# EAGLE design esp32comp (EAGLE 9.5.2)
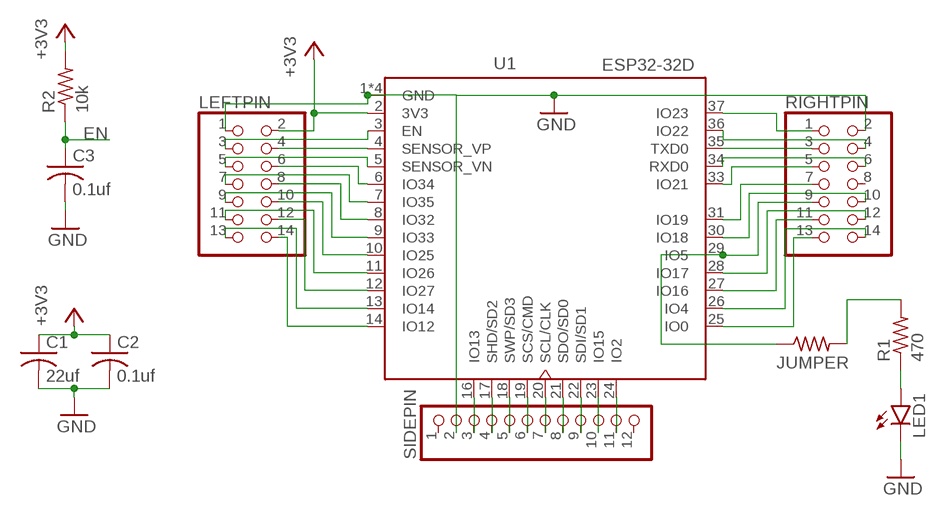
[diagram p0: schematic, sheet 1]

## Parts
C1  22uf  C-USC1210  [C1210]
C2  0.1uf  C-USC0805  [C0805]
C3  0.1uf  C-USC0805  [C0805]
JUMPER  RC0603JR-070RL  [RES_0603]
LED1  LEDSML0805  [SML0805]
LEFTPIN  PINHD-2X7  [2X07]
R1  470  R-US_R0805  [R0805]
R2  10k  R-US_R0805  [R0805]
RIGHTPIN  PINHD-2X7  [2X07]
SIDEPIN  PINHD-1X12  [1X12]
U1  ESP32-32D  [MODULE_ESP32-WROOM-32D]

## Nets
+3V3: C1.1 C2.1 LEFTPIN.2 R2.2 U1.2(3V3)
EN: C3.1 LEFTPIN.3 R2.1 U1.3(EN)
GND: C1.2 C2.2 C3.2 LED1.C LEFTPIN.1 RIGHTPIN.2 SIDEPIN.2 U1.1(GND) U1.15(GND) U1.38(GND) U1.39(GND)
IO0: RIGHTPIN.13 U1.25(IO0)
IO2: SIDEPIN.11 U1.24(IO2)
N$1: LED1.A R1.1
N$2: JUMPER.2 R1.2
N$3: SIDEPIN.10 U1.23(IO15)
N$10: SIDEPIN.3 U1.16(IO13)
N$13: LEFTPIN.4 U1.4(SENSOR_VP)
N$14: LEFTPIN.5 U1.5(SENSOR_VN)
N$15: LEFTPIN.6 U1.6(IO34)
N$16: LEFTPIN.7 U1.7(IO35)
N$17: LEFTPIN.8 U1.8(IO32)
N$18: LEFTPIN.9 U1.9(IO33)
N$19: LEFTPIN.10 U1.10(IO25)
N$20: LEFTPIN.11 U1.11(IO26)
N$21: LEFTPIN.12 U1.12(IO27)
N$22: LEFTPIN.13 U1.13(IO14)
N$23: LEFTPIN.14 U1.14(IO12)
N$24: RIGHTPIN.1 U1.37(IO23)
N$25: RIGHTPIN.4 U1.36(IO22)
N$28: RIGHTPIN.5 U1.33(IO21)
N$29: RIGHTPIN.7 U1.31(IO19)
N$30: RIGHTPIN.10 U1.30(IO18)
N$31: JUMPER.1 RIGHTPIN.9 U1.29(IO5)
N$33: RIGHTPIN.12 U1.28(IO17)
N$34: RIGHTPIN.11 U1.27(IO16)
N$35: RIGHTPIN.14 U1.26(IO4)
RXD0: RIGHTPIN.6 U1.34(RXD0)
SCL/CLK: SIDEPIN.7 U1.20(SCL/CLK)
SCS/CMD: SIDEPIN.6 U1.19(SCS/CMD)
SDI/SD1: SIDEPIN.9 U1.22(SDI/SD1)
SDO/SD0: SIDEPIN.8 U1.21(SDO/SD0)
SHD/SD2: SIDEPIN.4 U1.17(SHD/SD2)
SWP/SD3: SIDEPIN.5 U1.18(SWP/SD3)
TXD0: RIGHTPIN.3 U1.35(TXD0)
Unconnected: RIGHTPIN.8 SIDEPIN.1 SIDEPIN.12

## Library data of the parts
C1-C3 = rcl:C-US: CAPACITOR, American symbol; SPICEPREFIX: C
JUMPER = Resistor_Capacitor:RC0603JR-070RL: RES SMD 0 OHM JUMPER 1/10W 0603 Manufacturer's datasheet <http://www.yageo.com/documents/recent/PYu-RC_Group_51_RoHS_L_10.pdf>; CREATED_BY: PCBLayout.com; DIGIKEY_PART_NUMBER: 311-0.0GRTR-ND; MANUFACTURER: Yageo; MPN: RC0603JR-070RL; PACKAGE: SMD 0603
LED1 = led:LED: LED OSRAM: - CHIPLED LG R971, LG N971, LY N971, LG Q971, LY Q971, LO R971, LY R971 LH N974, LH R974 LS Q976, LO Q976, LY Q976 LO Q996 - Hyper CHIPLED LW Q18S LB Q993, LB Q99A, LB R99A - SideLED LS A670, LO A670, LY A670, LG A670, LP A670 LB A673, LV A673, LT A673, LW A673 LH A674 LY A675 LS A676, LA A676, LO A676, LY A676, LW A676 LS A679, LY A679, LG A679 - Hyper Micro SIDELED® LS Y876, LA Y876, LO Y876, LY Y876 LT Y87S - SmartLED LW L88C, LW L88S LB L89C, LB L89S, LG L890 LS L89K, LO L89K, LY L89K LS L896, LA L896, LO L896, LY L896 - TOPLED LS T670, LO T670, LY T670, LG T670, LP T670 LSG T670, LSP T670, LSY T670, LOP T670, LYG T670 LG T671, LOG T671, LSG T671 LB T673, LV T673, LT T673, LW T673 LH T674 LS T676, LA T676, LO T676, LY T676, LB T676, LH T676, LSB T676, LW T676 LB T67C, LV T67C, LT T67C, LS T67K, LO T67K, LY T67K, LW E67C LS E67B, LA E67B, LO E67B, LY E67B, LB E67C, LV E67C, LT E67C LW T67C LS T679, LY T679, LG T679 LS T770, LO T770, LY T770, LG T770, LP T770 LB T773, LV T773, LT T773, LW T773 LH T774 LS E675, LA E675, LY E675, LS T675 LS T776, LA T776, LO T776, LY T776, LB T776 LHGB T686 LT T68C, LB T68C - Hyper Mini TOPLED® LB M676 - Mini TOPLED Santana® LG M470 LS M47K, LO M47K, LY M47K Source: http://www.osram.convergy.de LUXEON: - LUMILED® LXK2-PW12-R00, LXK2-PW12-S00, LXK2-PW14-U00, LXK2-PW14-V00 LXK2-PM12-R00, LXK2-PM12-S00, LXK2-PM14-U00 LXK2-PE12-Q00, LXK2-PE12-R00, LXK2-PE12-S00, LXK2-PE14-T00, LXK2-PE14-U00 LXK2-PB12-K00, LXK2-PB12-L00, LXK2-PB12-M00, LXK2-PB14-N00, LXK2-PB14-P00, LXK2-PB14-Q00 LXK2-PR12-L00, LXK2-PR12-M00, LXK2-PR14-Q00, LXK2-PR14-R00 LXK2-PD12-Q00, LXK2-PD12-R00, LXK2-PD12-S00 LXK2-PH12-R00, LXK2-PH12-S00 LXK2-PL12-P00, LXK2-PL12-Q00, LXK2-PL12-R00 Source: www.luxeon.com KINGBRIGHT: KA-3528ASYC Source: www.kingbright.com
LEFTPIN RIGHTPIN = pinhead:PINHD-2X7: PIN HEADER
R1 R2 = rcl:R-US_: RESISTOR, American symbol; SPICEPREFIX: R
SIDEPIN = pinhead:PINHD-1X12: PIN HEADER
U1 = CustomParts:ESP32-32D: IC: SoC; GPIO, I2C, I2S, IR, SD, SDIO, SPI, UART; 2.7÷3.6VDC; 20dBm; AVAILABILITY: Unavailable; DESCRIPTION: Bluetooth, WiFi 802.11b/g/n, Bluetooth v4.2 + EDR, Class 1, 2 and 3 Transceiver Module 2.4GHz ~ 2.5GHz Integrated, Trace Surface Mount; MF: Espressif Systems; MP: ESP32-WROOM-32D; PACKAGE: Module Espressif Systems; PRICE: None

## Board
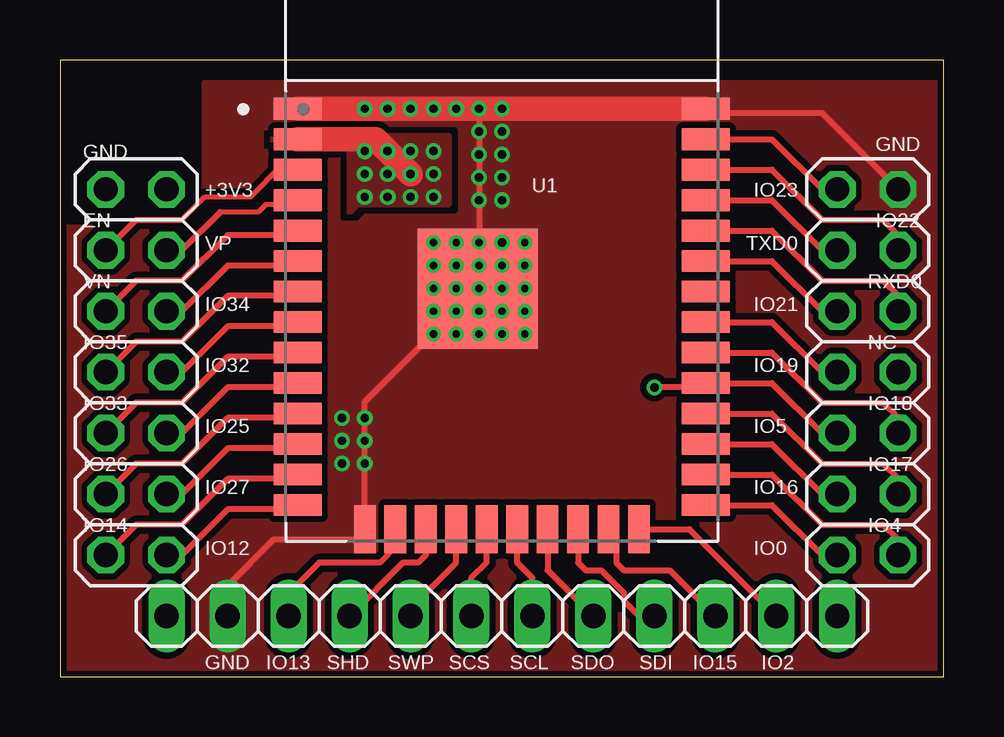
[diagram p1: board, top side]
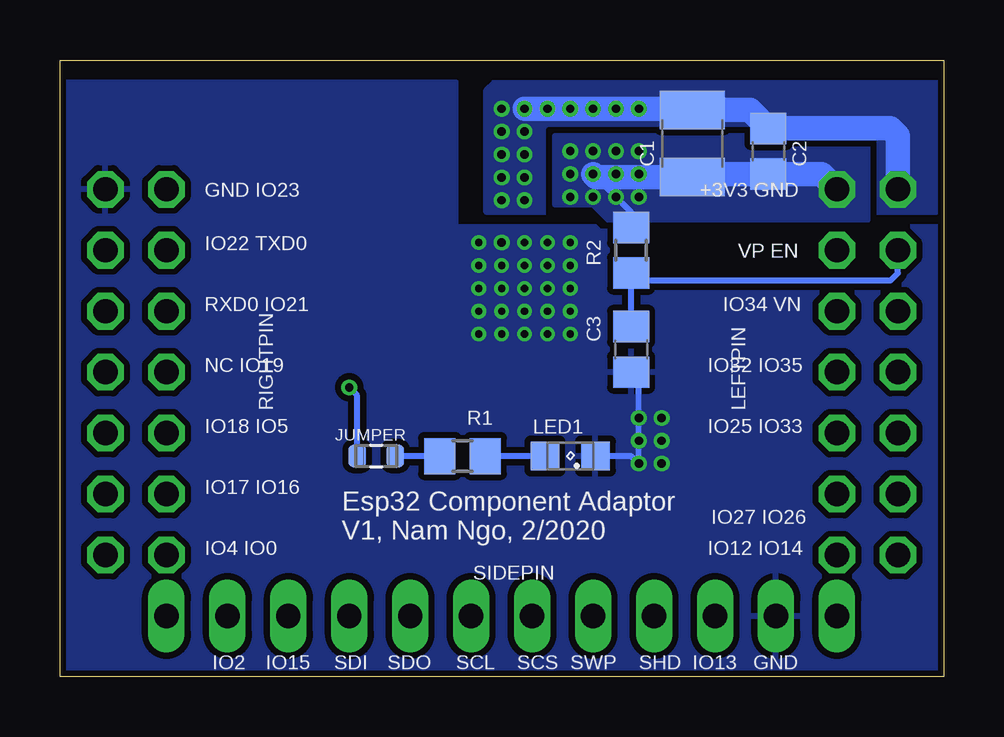
[diagram p2: board, bottom side, seen from below]

Size 36.82 x 25.71 mm. Coordinates in mm from the lower left corner, seen from the top.
Outline: 0,0 36.82,0 36.82,25.71 0,25.71 0,0
Copper layers (1*16): Top 0.035mm / dielectric 1.5mm / Bottom 0.035mm
Design rules "dirt_cheap_dirty_boards.v1.1": minimum track width 6mil, minimum drill 12mil, track to track 6mil, track to pad 6mil, pad to pad 6mil, via to via 6mil, smd to smd 0mil, copper to edge 10mil, drill to drill 10mil, minimum pad ring 10mil, minimum via ring 6mil, stop-mask expansion 2mil, vias tented up to drill 25mil, thermal gap 10mil

### Footprints (pad centres in the part's own frame; a part is rotated, then mirrored left to right if it is on the bottom)
C1210 = smd 1.6 x 2.7: 1 -1.4,0; 2 1.4,0
C0805 = smd 1.3 x 1.5: 1 -0.95,0; 2 0.95,0
RES_0603 = smd 0.74 x 0.93: 1 -0.795,0; 2 0.795,0
SML0805 = smd 1.2 x 1.2: A 1.05,0; C -1.05,0
2X07 = drill 1.016 octagon: 1 -7.62,-1.27; 2 -7.62,1.27; 3 -5.08,-1.27; 4 -5.08,1.27; 5 -2.54,-1.27; 6 -2.54,1.27; 7 0,-1.27; 8 0,1.27; 9 2.54,-1.27; 10 2.54,1.27; 11 5.08,-1.27; 12 5.08,1.27; 13 7.62,-1.27; 14 7.62,1.27
R0805 = smd 1.3 x 1.5: 1 -0.95,0; 2 0.95,0
1X12 = drill 1.016 long: 1 -13.97,0; 2 -11.43,0; 3 -8.89,0; 4 -6.35,0; 5 -3.81,0; 6 -1.27,0; 7 1.27,0; 8 3.81,0; 9 6.35,0; 10 8.89,0; 11 11.43,0; 12 13.97,0
MODULE_ESP32-WROOM-32D = smd 2 x 0.9: 1 -8.5,5.26; 2 -8.5,3.99; 3 -8.5,2.72; 4 -8.5,1.45; 5 -8.5,0.18; 6 -8.5,-1.09; 7 -8.5,-2.36; 8 -8.5,-3.63; 9 -8.5,-4.9; 10 -8.5,-6.17; 11 -8.5,-7.44; 12 -8.5,-8.71; 13 -8.5,-9.98; 14 -8.5,-11.25; 25 8.5,-11.25; 26 8.5,-9.98; 27 8.5,-8.71; 28 8.5,-7.44; 29 8.5,-6.17; 30 8.5,-4.9; 31 8.5,-3.63; 32 8.5,-2.36; 33 8.5,-1.09; 34 8.5,0.18; 35 8.5,1.45; 36 8.5,2.72; 37 8.5,3.99; 38 8.5,5.26 | smd 0.9 x 2: 15 -5.715,-12.25; 16 -4.445,-12.25; 17 -3.175,-12.25; 18 -1.905,-12.25; 19 -0.635,-12.25; 20 0.635,-12.25; 21 1.905,-12.25; 22 3.175,-12.25; 23 4.445,-12.25; 24 5.715,-12.25 | smd 5 x 5: 39 -1,-2.24

### Placement (x,y rotation side)
C1  10.48,22.22 90 bottom
C2  7.3,21.91 90 bottom
C3  13.02,13.65 270 bottom
JUMPER  23.64,9.21 0 bottom
LED1  15.56,9.21 180 bottom
LEFTPIN  3.18,12.7 270 top
R1  20.04,9.21 180 bottom
R2  13.02,17.78 90 bottom
RIGHTPIN  33.66,12.7 270 top
SIDEPIN  18.41,2.54 0 top
U1  18.41,18.42 0 top

### Tracks (layer width: path | path; a pad name or v marks a point on that pad's centre or on a via)
+3V3  (via drill 0.35)
  Top 1.016: U1.2 13.16,22.41 v14.61,20.96
  Bottom 0.254: R2.2 13.02,19.37 14.48,20.82
  Bottom 1.016: LEFTPIN.2 5.08,20.96 C2.1 10.35,20.96 C1.1 14.48,20.82 v14.61,20.96
  other vias: 13.65,20.96 12.7,20.96 12.7,20 13.65,20 14.61,20 12.7,21.91 13.65,21.91 14.61,21.91 15.56,21.91 15.56,20.96 15.56,20
  pour Bottom (isolate 0.254, no thermals): 3.18,19.05 13.97,19.05 14.61,19.68 16.19,19.68 16.19,22.54 3.18,22.54
  pour Top (isolate 0.254): 8.89,22.54 16.19,22.54 16.19,19.68 12.38,19.68 12.07,19.37 12.07,22.22 8.89,22.22
EN
  Top 0.203: 5.08,19.05 6.03,20 7.94,20 9.21,21.27 9.78,21.27 U1.3
  Top 0.254: 5.08,19.05 3.18,19.05 LEFTPIN.3
  Bottom 0.254: C3.1 R2.1 | R2.1 | LEFTPIN.3 1.91,16.83 2.22,16.51 12.7,16.51 R2.1
GND  (via drill 0.3, 0.35)
  Top 0.254: SIDEPIN.2 6.98,3.81 8.89,5.71 12.25,5.71 U1.15 v12.7,8.89 12.7,11.46 17.46,16.22 v17.46,23.68 | RIGHTPIN.2 31.75,23.5 27.09,23.5 U1.38 | U1.39 17.45,16.21 17.45,16.19
  Top 1.016: 17.46,16.21 17.45,16.19 | U1.38 v17.46,23.68 U1.1 | 17.46,16.22 U1.39
  Bottom 0.254: LED1.C 13.02,9.21 v12.7,8.89 12.7,12.39 C3.2
  Bottom 1.016: LEFTPIN.1 1.91,22.54 2.22,22.86 C2.2 8.07,23.63 C1.2 | C1.2 10.66,23.81 | v17.46,23.68 10.53,23.68 C1.2
  other vias: 12.7,23.68 13.65,23.68 14.61,23.68 15.56,23.68 16.51,23.68 18.41,23.68 18.41,22.72 18.41,21.77 18.41,20.82 18.41,19.86 17.46,19.86 17.46,20.82 17.46,21.77 17.46,22.72 18.41,17.14 17.46,18.1 19.37,17.14 19.37,16.19 19.37,15.24 19.37,14.29 19.37,18.1 18.41,16.19 18.41,15.24 18.41,14.29 17.46,14.29 17.46,15.24 17.46,16.19 17.46,17.14 16.51,18.1 16.51,17.14 16.51,16.19 16.51,15.24 16.51,14.29 15.56,14.29 15.56,15.24 15.56,16.19 15.56,17.14 15.56,18.1 18.41,18.1 12.7,9.84 11.75,9.84 11.75,8.89 11.75,10.8 12.7,10.8
  pour Bottom (isolate 0.254, rank 5, no thermals): 0.32,19.37 19.05,19.37 19.05,24.45 18.73,24.77 0.32,24.77
  pour Bottom (isolate 0.254, rank 5): 0,18.73 20.32,18.73 20.32,24.77 36.83,24.77 36.83,0 0,0
  pour Top (isolate 0.254, rank 5, no thermals): 0,18.73 6.03,18.73 6.03,24.77 36.83,24.77 36.83,0 0,0
IO0
  Top 0.254: U1.25 29.66,7.17 31.75,5.08 RIGHTPIN.13
IO2
  Top 0.254: U1.24 26.22,6.17 SIDEPIN.11
N$1
  Bottom 0.254: LED1.A R1.1
N$2
  Bottom 0.254: R1.2 JUMPER.2
N$3
  Top 0.254: U1.23 23.18,5.85 23.18,4.76 23.49,4.45 25.4,4.45 SIDEPIN.10
N$10
  Top 0.254: U1.16 13.97,5.4 13.34,4.76 10.8,4.76 9.53,3.49 SIDEPIN.3
N$13
  Top 0.203: U1.4 9.73,19.68 8.57,19.68 8.26,19.37 6.67,19.37
  Top 0.254: 6.67,19.37 5.08,17.78 LEFTPIN.4
N$14
  Top 0.254: U1.5 9.73,18.42 6.98,18.42 5.08,16.51 3.18,16.51 LEFTPIN.5
N$15
  Top 0.254: U1.6 9.73,17.14 6.98,17.14 5.08,15.24 LEFTPIN.6
N$16
  Top 0.254: U1.7 9.73,15.88 6.98,15.88 5.08,13.97 3.18,13.97 LEFTPIN.7
N$17
  Top 0.254: U1.8 9.73,14.61 6.98,14.61 5.08,12.7 LEFTPIN.8
N$18
  Top 0.254: U1.9 9.73,13.34 6.98,13.34 5.08,11.43 3.18,11.43 LEFTPIN.9
N$19
  Top 0.254: U1.10 9.73,12.07 6.98,12.07 5.08,10.16 LEFTPIN.10
N$20
  Top 0.254: U1.11 9.73,10.8 6.98,10.8 5.08,8.89 3.18,8.89 LEFTPIN.11
N$21
  Top 0.254: U1.12 9.73,9.53 6.98,9.53 5.08,7.62 LEFTPIN.12
N$22
  Top 0.254: U1.13 9.73,8.26 6.98,8.26 5.08,6.35 3.18,6.35 LEFTPIN.13
N$23
  Top 0.254: U1.14 9.73,6.99 6.98,6.99 5.08,5.08 LEFTPIN.14
N$24
  Top 0.254: U1.37 29.66,22.41 31.75,20.32 RIGHTPIN.1
N$25
  Top 0.254: U1.36 29.66,21.14 31.75,19.05 34.29,19.05 34.93,18.42 RIGHTPIN.4
N$28
  Top 0.254: U1.33 29.66,17.32 31.75,15.24 RIGHTPIN.5
N$29
  Top 0.254: U1.31 29.66,14.79 31.75,12.7 RIGHTPIN.7
N$30
  Top 0.254: U1.30 29.66,13.52 31.75,11.43 34.29,11.43 34.93,10.8 RIGHTPIN.10
N$31  (via drill 0.35)
  Top 0.254: RIGHTPIN.9 31.75,10.16 29.66,12.25 U1.29 26.73,12.07 v24.77,12.07
  Bottom 0.254: JUMPER.1 24.44,11.74 v24.77,12.07
N$33
  Top 0.254: U1.28 29.66,10.98 31.75,8.89 34.29,8.89 34.93,8.26 RIGHTPIN.12
N$34
  Top 0.254: U1.27 29.66,9.71 31.75,7.62 RIGHTPIN.11
N$35
  Top 0.254: U1.26 29.66,8.44 31.75,6.35 34.29,6.35 34.93,5.71 RIGHTPIN.14
RXD0
  Top 0.254: U1.34 29.66,18.6 31.75,16.51 34.29,16.51 34.93,15.88 RIGHTPIN.6
SCL/CLK
  Top 0.254: SIDEPIN.7 19.69,4.13 19.05,4.76 U1.20
SCS/CMD
  Top 0.254: SIDEPIN.6 17.15,4.13 17.78,4.76 U1.19
SDI/SD1
  Top 0.254: U1.22 21.59,4.76 21.91,4.45 22.55,4.45 23.49,3.51 23.49,3.18 24.13,2.54 SIDEPIN.9
SDO/SD0
  Top 0.254: SIDEPIN.8 20.32,4.45 U1.21
SHD/SD2
  Top 0.254: U1.17 15.24,5.08 14.92,4.76 14.29,4.76 SIDEPIN.4
SWP/SD3
  Top 0.254: SIDEPIN.5 14.61,2.86 16.51,4.76 U1.18
TXD0
  Top 0.254: U1.35 29.66,19.86 31.75,17.78 RIGHTPIN.3

### Text on the board
tPlace: GND | GND | +3V3 | IO23 | EN | IO22 | VP | TXD0 | VN | RXD0 | IO34 | IO21 | IO35 | NC | IO32 | IO19 | IO33 | IO18 | IO25 | IO5 | IO26 | IO17 | IO27 | IO16 | IO14 | IO4 | IO12 | IO0 | GND | IO13 | SHD | SWP | SCS | SCL | SDO | SDI | IO15 | IO2
bPlace: +3V3 GND | GND IO23 | VP EN | IO22 TXD0 | IO34 VN | RXD0 IO21 | IO32 IO35 | NC IO19 | IO25 IO33 | IO18 IO5 | IO27 IO26 | IO17 IO16 | IO12 IO14 | Esp32 Component Adaptor / V1, Nam Ngo, 2/2020 | IO4 IO0 | GND | IO13 | SHD | SWP | SCS | SCL | SDO | SDI | IO15 | IO2